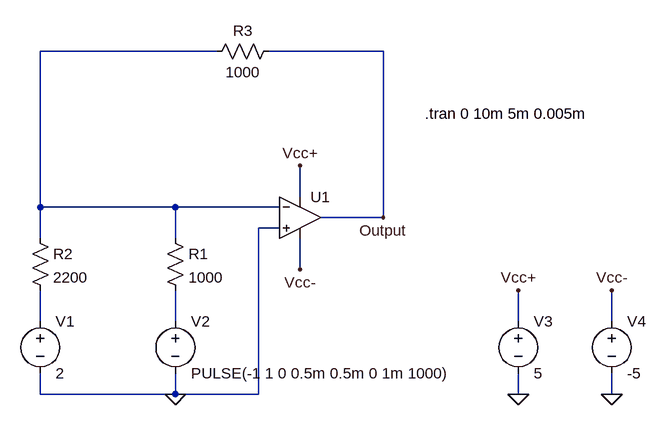
[diagram p0: schematic Circuito_sesion6.asc]
Circuito_sesion6.asc, the LTspice schematic file:
Version 4
SHEET 1 888 680
WIRE 208 -416 -64 -416
WIRE 464 -416 288 -416
WIRE 336 -192 336 -240
WIRE -64 -176 -64 -416
WIRE 144 -176 -64 -176
WIRE 304 -176 144 -176
WIRE 464 -160 464 -416
WIRE 464 -160 368 -160
WIRE 304 -144 272 -144
WIRE -64 -128 -64 -176
WIRE 144 -128 144 -176
WIRE 336 -80 336 -128
WIRE -64 0 -64 -48
WIRE 144 0 144 -48
WIRE 672 0 672 -48
WIRE 816 0 816 -48
WIRE -64 112 -64 80
WIRE 144 112 144 80
WIRE 144 112 -64 112
WIRE 272 112 272 -144
WIRE 272 112 144 112
WIRE 672 112 672 80
WIRE 816 112 816 80
FLAG 144 112 0
FLAG 672 112 0
FLAG 816 112 0
FLAG 672 -48 Vcc+
FLAG 336 -240 Vcc+
FLAG 816 -48 Vcc-
FLAG 336 -80 Vcc-
FLAG 464 -160 Output
SYMBOL voltage -64 -16 R0
WINDOW 123 0 0 Left 2
WINDOW 39 0 0 Left 2
SYMATTR InstName V1
SYMATTR Value 2
SYMBOL res 128 -144 R0
SYMATTR InstName R1
SYMATTR Value 1000
SYMBOL res -80 -144 R0
SYMATTR InstName R2
SYMATTR Value 2200
SYMBOL voltage 144 -16 R0
WINDOW 123 0 0 Left 2
WINDOW 39 0 0 Left 2
SYMATTR InstName V2
SYMATTR Value PULSE(-1 1 0 0.5m 0.5m 0 1m 1000)
SYMBOL voltage 672 -16 R0
WINDOW 123 0 0 Left 2
WINDOW 39 0 0 Left 2
SYMATTR InstName V3
SYMATTR Value 5
SYMBOL voltage 816 -16 R0
WINDOW 123 0 0 Left 2
WINDOW 39 0 0 Left 2
SYMATTR InstName V4
SYMATTR Value -5
SYMBOL res 304 -432 R90
WINDOW 0 0 56 VBottom 2
WINDOW 3 32 56 VTop 2
SYMATTR InstName R3
SYMATTR Value 1000
SYMBOL Opamps\\UniversalOpamp2 336 -160 R0
SYMATTR InstName U1
TEXT 528 -320 Left 2 !.tran 0 10m 5m 0.005m

The netlist it stands for:
* Circuito_sesion6.asc
V1 N002 0 2
R1 N001 N003 1000
R2 N001 N002 2200
V2 N003 0 PULSE(-1 1 0 0.5m 0.5m 0 1m 1000)
V3 Vcc+ 0 5
V4 Vcc- 0 -5
R3 Output N001 1000
XU1 0 N001 Vcc+ Vcc- Output level.2 Avol=1Meg GBW=10Meg Slew=10Meg ilimit=25m rail=0 Vos=0 phimargin=45 en=0 enk=0 in=0 ink=0 Rin=500Meg  ; pins IN+ IN- V+ V- OUT
.tran 0 10m 5m 0.005m
.lib UniversalOpamps2.sub
.backanno
.end